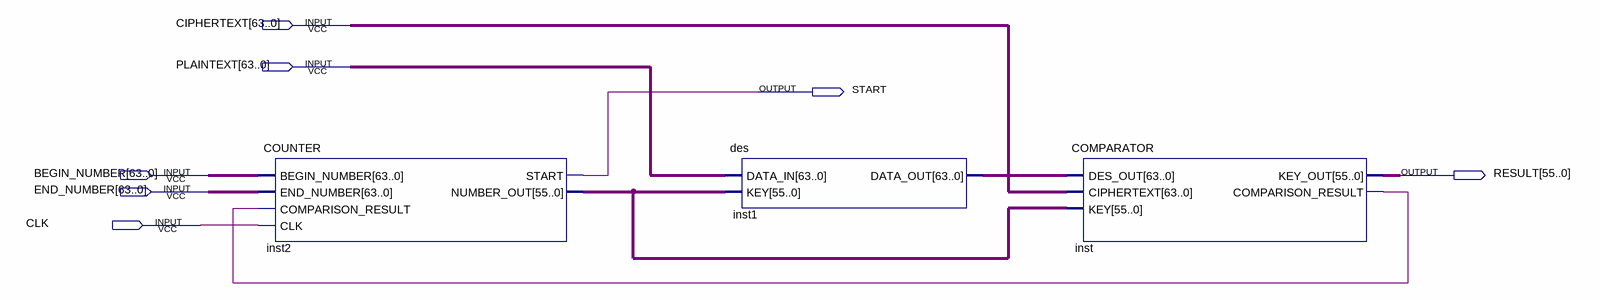
[diagram p0: schematic sheet]
// Quartus schematic DONE.bdf as structural Verilog: 3 symbols, 7 pins
module DONE (
  input  [63:0] CIPHERTEXT,
  input  [63:0] PLAINTEXT,
  input  [63:0] BEGIN_NUMBER,
  input  [63:0] END_NUMBER,
  input  CLK,
  output START,
  output [55:0] RESULT
);

  wire inst_comparison_result;
  wire [55:0] inst2_number_out;
  wire [63:0] inst1_data_out;

  COUNTER inst2 (
    .BEGIN_NUMBER(BEGIN_NUMBER), .END_NUMBER(END_NUMBER), .COMPARISON_RESULT(inst_comparison_result),
    .CLK(CLK), .START(START), .NUMBER_OUT(inst2_number_out));
  des inst1 (.DATA_IN(PLAINTEXT), .KEY(inst2_number_out), .DATA_OUT(inst1_data_out));
  COMPARATOR inst (
    .DES_OUT(inst1_data_out), .CIPHERTEXT(CIPHERTEXT), .KEY(inst2_number_out), .KEY_OUT(RESULT),
    .COMPARISON_RESULT(inst_comparison_result));
endmodule
